# Altium project ESP32_Board - Mobile Robot.PrjPcb
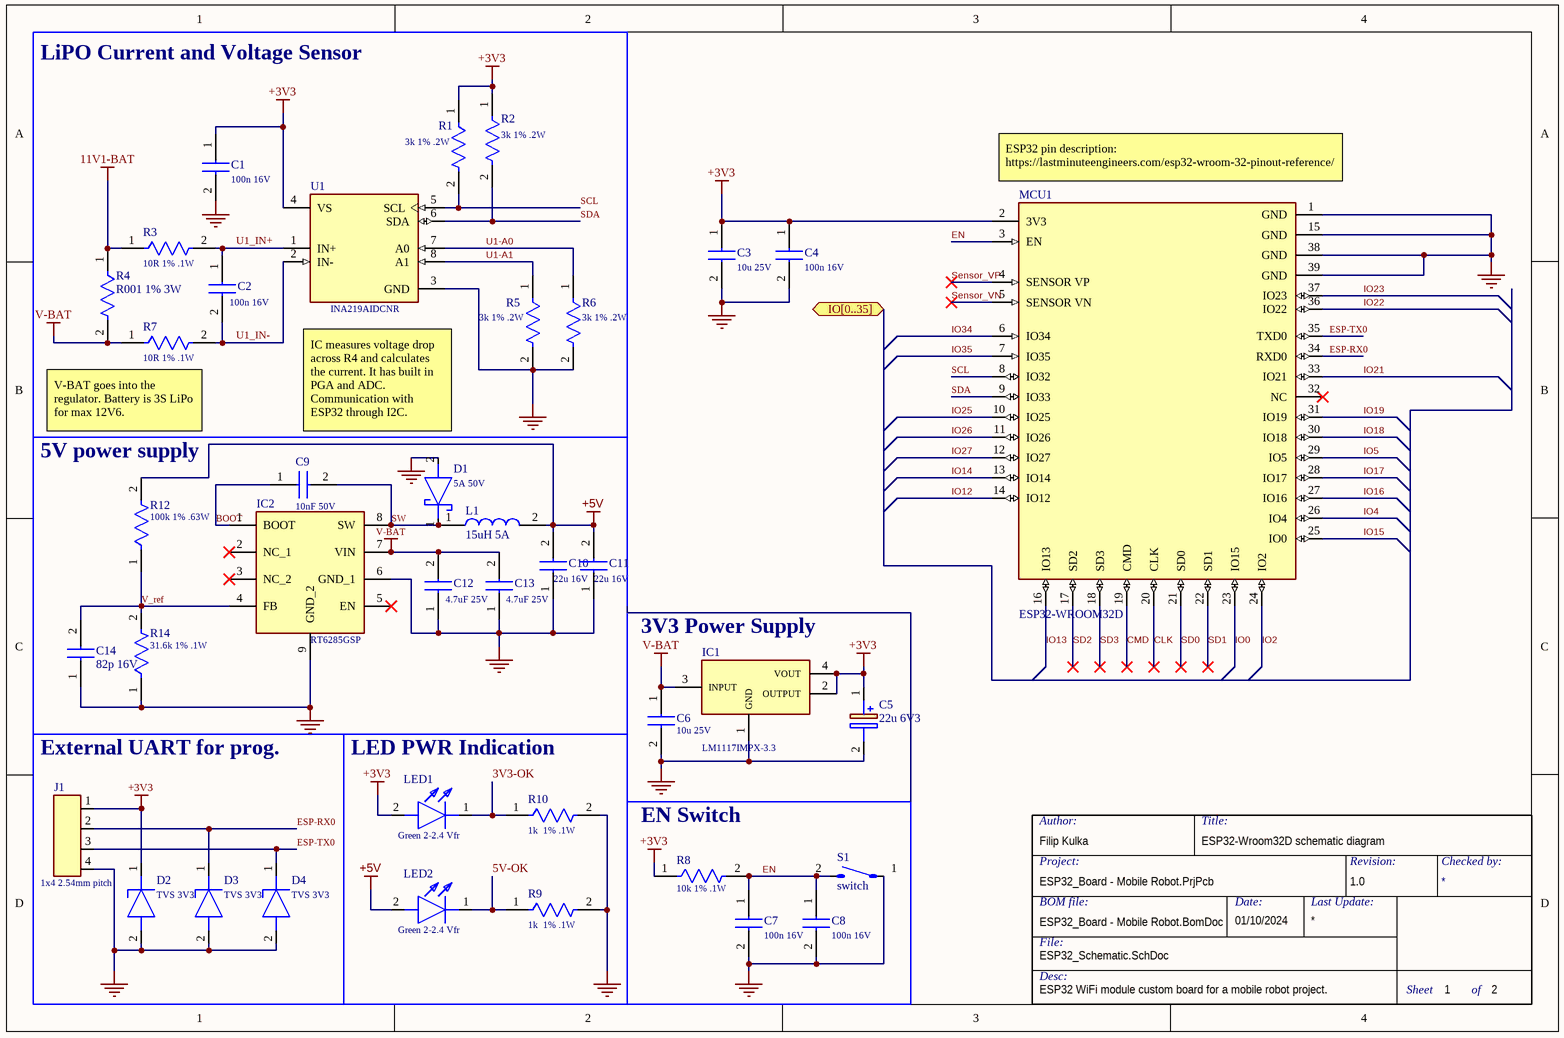
[diagram p0: ESP32_Schematic.SchDoc]

2 sheets, 66 parts. Net scope: flat (ports and power ports of the same name join across sheets).
Board file: ESP32_Board.PcbDoc
Sheets:
  ESP32_Schematic.SchDoc
  ESP32-connectors&Battery.SchDoc

## Sheet ESP32_Schematic.SchDoc: ESP32-Wroom32D schematic diagram
size A4; Date: 01/10/2024; Author: Filip Kulka; DocumentNumber: 1; Revision: 1.0; SheetNumber: 1; SheetTotal: 2; Desc: ESP32 WiFi module custom board for a mobile robot project.; BOM: ESP32_Board - Mobile Robot.BomDoc

### Parts
(Parts that share a designator on the sheet are numbered #1, #2 ... from top to bottom, then left to right.)
?#1  (no value)
C1  100n 16V  [CAPC1608X90N]
C2  100n 16V  [CAPC1608X90N]
C3  10u 25V  [CAPC1608X90N]
C4  100n 16V  [CAPC1608X90N]
C5  22u 6V3  [T491B]
C6  10u 25V  [CAPC1608X90N]
C7  100n 16V  [CAPC1608X90N]
C8  100n 16V  [CAPC1608X90N]
C9  10nF 50V  [CAPC1608X90N]
C10  22u 16V  [CAPC1608X100N]
C11  22u 16V  [CAPC1608X100N]
C12  4.7uF 25V  [CAPC1608X80N]
C13  4.7uF 25V  [CAPC1608X80N]
C14  82p 16V  [C0402C104J4RACTU]
D1  5A 50V  [DIOM7959X250N]
D2  TVS 3V3  [PESD3V3U1UB115]
D3  TVS 3V3  [PESD3V3U1UB115]
D4  TVS 3V3  [PESD3V3U1UB115]
IC1  LM1117IMPX-3.3  [SOT230P700X180-4N]
IC2  RT6285GSP  [SOIC127P600X175-9N]
J1  1x4 2.54mm pitch  [HDRV4W66P0X254_1X4_1016X249X1003P]
L1  15uH 5A  [INDPM7266X300N]
LED1  Green 2-2.4 Vfr  [LEDC1608X80N]
LED2  Green 2-2.4 Vfr  [LEDC1608X80N]
MCU1  ESP32-WROOM32D  [ESP32-Wroom32D]
R1  3k 1% .2W  [RESC1005X40N]
R2  3k 1% .2W  [RESC1005X40N]
R3  10R 1% .1W  [RESC1608X55N]
R4  R001 1% 3W  [RESC6430X80N]
R5  3k 1% .2W  [RESC1005X40N]
R6  3k 1% .2W  [RESC1005X40N]
R7  10R 1% .1W  [RESC1608X55N]
R8  10k 1% .1W  [RESC1608X60N]
R9  1k  1% .1W  [RESC1608X55N]
R10  1k  1% .1W  [RESC1608X55N]
R12  100k 1% .63W  [RESC1005X35N]
R14  31.6k 1% .1W  [RESC1005X40N]
S1  switch  [434123025816]
U1  INA219AIDCNR  [FP-DCN0008A-IPC_B]

### Ports
IO[0..35] (bidir, see ESP32-connectors&Battery[1A], ESP32-connectors&Battery[1B], ESP32-connectors&Battery[1C])

### Nets
11V1-BAT: R3.1 R4.1
+3V3: C1.1 C3.1 C4.1 C5.1(+) D2.1(K) IC1.2(OUTPUT) IC1.4(VOUT) J1.1 LED1.2(A) MCU1.2(3V3) R1.1 R2.1 R8.1 U1.4(VS)
+5V: C10.2 C11.2 L1.2 LED2.2(A) R12.2
GND: C1.2 C3.2 C4.2 C5.2(-) C6.2 C7.2 C8.2 C10.1 C11.1 C12.1 C13.1 C14.1 D1.2(A) D2.2(A) D3.2(A) D4.2(A) IC1.1(GND) IC2.6(GND_1) IC2.9(GND_2) J1.4 MCU1.1(GND) MCU1.15(GND) MCU1.38(GND) MCU1.39(GND) R5.2 R6.2 R9.2 R10.2 R14.1 S1.1(COM) U1.3(GND)
V-BAT: C6.1 C12.2 C13.2 IC1.3(INPUT) IC2.7(VIN) R4.2 R7.1
3V3-OK: LED1.1(K) R10.1
5V-OK: LED2.1(K) R9.1
BOOT: C9.1 IC2.1(BOOT)
CLK: MCU1.20(CLK)
CMD: MCU1.19(CMD)
EN: C7.1 C8.1 MCU1.3(EN) R8.2 S1.2(NO)
ESP-RX0: D3.1(K) J1.2 MCU1.34(RXD0)
ESP-TX0: D4.1(K) J1.3 MCU1.35(TXD0)
IO0: MCU1.23(IO15)
IO2: MCU1.24(IO2)
IO4: MCU1.26(IO4)
IO5: MCU1.29(IO5)
IO12: MCU1.14(IO12)
IO13: MCU1.16(IO13)
IO14: MCU1.13(IO14)
IO15: MCU1.25(IO0)
IO16: MCU1.27(IO16)
IO17: MCU1.28(IO17)
IO18: MCU1.30(IO18)
IO19: MCU1.31(IO19)
IO21: MCU1.33(IO21)
IO22: MCU1.36(IO22)
IO23: MCU1.37(IO23)
IO25: MCU1.10(IO25)
IO26: MCU1.11(IO26)
IO27: MCU1.12(IO27)
IO34: MCU1.6(IO34)
IO35: MCU1.7(IO35)
SCL: MCU1.8(IO32) R1.2 U1.5(SCL)
SD0: MCU1.21(SD0)
SD1: MCU1.22(SD1)
SD2: MCU1.17(SD2)
SD3: MCU1.18(SD3)
SDA: MCU1.9(IO33) R2.2 U1.6(SDA)
Sensor_VN: MCU1.5(SENSOR_VN)
Sensor_VP: MCU1.4(SENSOR_VP)
SW: C9.2 D1.1(K) IC2.8(SW) L1.1
U1-A0: R6.1 U1.7(A0)
U1-A1: R5.1 U1.8(A1)
U1_IN+: C2.1 R3.2 U1.1(IN+)
U1_IN-: C2.2 R7.2 U1.2(IN-)
V_ref: C14.2 IC2.4(FB) R12.1 R14.2

Not connected (* = marked no-connect by the designer): IC2 2(NC_1)* 3(NC_2)* 5(EN)*; MCU1 32(NC)*

### Notes on the sheet
- LiPO Current and Voltage Sensor
- (near MCU1) ESP32 pin description:
  https://lastminuteengineers.com/esp32-wroom-32-pinout-reference/
- (near R7) V-BAT goes into the regulator. Battery is 3S LiPo for max 12V6.
- IC measures voltage drop across R4 and calculates the current. It has built in PGA and ADC. Communication with ESP32 through I2C.
- (near R12) 5V power supply
- (near IC1) 3V3 Power Supply
- External UART for prog.
- LED PWR Indication
- EN Switch
- Author:
- Title:
- Project:
- BOM file:
- Date:
- Last Update:
- Revision:
- Checked by:
- File:
- Desc:
- Sheet
- of

### Library data of the parts
?#1 = TitleBlock: This is a custom title block with my logo and a bit more info than the default one
C1 C2 C4 C7 C8 = 0603YC104K4T4A: 100nF 0603 16V; Manufacturer_Name: Kyocera AVX; Datasheet Link: https://componentsearchengine.com/Datasheets/1/06031A100FAT2A.pdf; Height: 0.9mm; Manufacturer_Part_Number: 0603YC104K4T4A; Mouser Part Number: 581-0603YC104K4T4A; Mouser Price/Stock: https://www.mouser.co.uk/ProductDetail/KYOCERA-AVX/0603YC104K4T4A?qs=Cej1j9ztgjEkPqVJkA4Bng%3D%3D; Arrow Part Number: 0603YC104K4T4A; Arrow Price/Stock: https://www.arrow.com/en/products/0603yc104k4t4a/avx
C3 C6 = 06033D106KAT2A: Cap. Ceramic 10uF 25V 10%; Manufacturer_Name: Kyocera AVX; Datasheet Link: https://componentsearchengine.com/Datasheets/1/06031A100FAT2A.pdf; Height: 0.9mm; Manufacturer_Part_Number: 06033D106KAT2A; Mouser Part Number: 581-06033D106KAT2A; Mouser Price/Stock: https://www.mouser.co.uk/ProductDetail/KYOCERA-AVX/06033D106KAT2A?qs=iLbezkQI%252BsjjhfqLL0ayMQ%3D%3D; Arrow Part Number: 06033D106KAT2A; Arrow Price/Stock: https://www.arrow.com/en/products/06033d106kat2a/avx?region=nac
C5 = T491B226K006AT: Capacitor Polarised; Manufacturer_Name: KEMET; Datasheet Link: https://content.kemet.com/datasheets/KEM_T2005_T491.pdf; Height: 2.1mm; Manufacturer_Part_Number: T491B226K006AT; Mouser Part Number: 80-T491B226K006; Mouser Price/Stock: https://www.mouser.co.uk/ProductDetail/KEMET/T491B226K006AT?qs=jcsBHvPDQt8yMdJgz62biA%3D%3D
C9 = GCM188R71H103KA37J: 10nF 50V 0603; Manufacturer_Name: Murata Electronics; Datasheet Link: https://psearch.en.murata.com/capacitor/product/GCM188R71H103KA37%23.pdf; Height: 0.9mm; Manufacturer_Part_Number: GCM188R71H103KA37J; Mouser Part Number: 81-GCM188R71H103KA7J; Mouser Price/Stock: https://www.mouser.co.uk/ProductDetail/Murata-Electronics/GCM188R71H103KA37J?qs=N3Kl9KD794T3%2FxlXdF0Axg%3D%3D; Arrow Part Number: GCM188R71H103KA37J; Arrow Price/Stock: https://www.arrow.com/en/products/gcm188r71h103ka37j/murata-manufacturing?region=nac
C10 C11 = CM105X5R226M16AT: 22uF 16V 0603 ceramic capacitor; Manufacturer_Name: Kyocera AVX; Datasheet Link: https://www.mouser.de/datasheet/2/40/Kyocera_AVX_Components_CT_Series_e-2933596.pdf; Height: 1mm; Manufacturer_Part_Number: CM105X5R226M16AT; Mouser Part Number: 581-CM105X5R226M16AT; Mouser Price/Stock: https://www.mouser.co.uk/ProductDetail/KYOCERA-AVX/CM105X5R226M16AT?qs=MyNHzdoqoQKX6cMyStcF%2FA%3D%3D
C12 C13 = C1608X5R1E475K080AC: 4.7uF 25V 10% X5R; Manufacturer_Name: TDK; Datasheet Link: https://product.tdk.com/info/en/catalog/datasheets/mlcc_commercial_midvoltage_en.pdf; Height: 0.8mm; Manufacturer_Part_Number: C1608X5R1E475K080AC; Mouser Part Number: 810-C1608X5R1E475K; Mouser Price/Stock: https://www.mouser.co.uk/ProductDetail/TDK/C1608X5R1E475K080AC?qs=dfay7wIA1uHUGZGvnFtOyQ%3D%3D; Arrow Part Number: C1608X5R1E475K080AC; Arrow Price/Stock: https://www.arrow.com/en/products/c1608x5r1e475k080ac/tdk?region=nac
C14 = C0402C820M4GACTU: 82pF 16V; Manufacturer_Name: KEMET; Datasheet Link: https://content.kemet.com/datasheets/KEM_C1002_X7R_SMD.pdf; Height: 0.55mm; Manufacturer_Part_Number: C0402C820M4GACTU
D1 = B550C-13-F: Schotkky Diode; Manufacturer_Name: Diodes Incorporated; Datasheet Link: https://www.mouser.com/ds/2/115/ds13012-1142526.pdf; Height: 2.5mm; Manufacturer_Part_Number: B550C-13-F; Mouser Part Number: 621-B550C-F; Mouser Price/Stock: https://www.mouser.co.uk/ProductDetail/Diodes-Incorporated/B550C-13-F?qs=UEP5Ic6BRave1jzuZzz4FA%3D%3D; Arrow Part Number: B550C-13-F; Arrow Price/Stock: https://www.arrow.com/en/products/b550c-13-f/diodes-incorporated?utm_currency=USD&region=nac
D2-D4 = PESD3V3U1UB,115: TVS diode 3V3 0402; Manufacturer_Name: Nexperia; Datasheet Link: https://assets.nexperia.com/documents/data-sheet/PESD3V3U1UB.pdf; Height: 0.65mm; Manufacturer_Part_Number: PESD3V3U1UB,115; Mouser Part Number: 771-PESD3V3U1UB-T/R; Mouser Price/Stock: https://www.mouser.co.uk/ProductDetail/Nexperia/PESD3V3U1UB115?qs=LOCUfHb8d9uLhBP9O5uXGg%3D%3D; Arrow Part Number: PESD3V3U1UB,115; Arrow Price/Stock: https://www.arrow.com/en/products/pesd3v3u1ub115/nexperia?region=nac
IC1 = LM1117IMP-3.3_NOPB: 3V3 Linear regulator; Manufacturer_Name: Texas Instruments; Manufacturer_Part_Number: LM1117IMP-3.3/NOPB; Datasheet Link: https://www.ti.com/lit/ds/symlink/lm1117.pdf?ts=1607578196475&ref_url=https%253A%252F%252Fwww.google.com%252F; Height: 1.8mm; Mouser Part Number: 926-LM1117IMP3.3NOPB; Mouser Price/Stock: https://www.mouser.co.uk/ProductDetail/Texas-Instruments/LM1117IMP-3.3-NOPB?qs=X1J7HmVL2ZFbpN1TgOsjYQ%3D%3D; Arrow Part Number: LM1117IMP-3.3/NOPB; Arrow Price/Stock: https://www.arrow.com/en/products/lm1117imp-3.3nopb/texas-instruments?utm_currency=USD&region=nac; Supplier 1: Mouser; Supplier Part Number 1: 926-LM1117IMP3.3NOPB
IC2 = RT6285GSP: Integrated Circuit; Manufacturer_Name: RICHTEK; Datasheet Link: https://www.richtek.com/assets/product_file/RT6285/DS6285-00.pdf; Height: 1.753mm; Manufacturer_Part_Number: RT6285GSP; Mouser Part Number: 835-RT6285GSP; Mouser Price/Stock: https://www.mouser.co.uk/ProductDetail/Richtek/RT6285GSP?qs=amGC7iS6iy9ag0U80PgEbw%3D%3D
J1 = 22-28-4042: Connector 1x4 / 2.54mm pitch / Through Hole straight; Manufacturer_Name: Molex; Datasheet Link: https://www.molex.com/content/dam/molex/molex-dot-com/products/automated/en-us/salesdrawingpdf/423/42375/022284042_sd.pdf?inline; Height: 10.03mm; Manufacturer_Part_Number: 22-28-4042; Mouser Part Number: 538-22-28-4042; Mouser Price/Stock: https://www.mouser.co.uk/ProductDetail/Molex/22-28-4042?qs=GAPJcf4kvdu6DqYOOlzdaQ%3D%3D
L1 = ASPI-0630LR-150M-T15: Manufacturer_Name: ABRACON; Datasheet Link: https://abracon.com/Magnetics/power/ASPI-0630LR.pdf; Height: 3mm; Manufacturer_Part_Number: ASPI-0630LR-150M-T15; Mouser Part Number: 815-ASPI0630LR150T15; Mouser Price/Stock: https://www.mouser.co.uk/ProductDetail/ABRACON/ASPI-0630LR-150M-T15?qs=bWAYEm3xoCYKmwZKzI2%2F7Q%3D%3D; Arrow Part Number: ASPI-0630LR-150M-T15; Arrow Price/Stock: https://www.arrow.com/en/products/aspi-0630lr-150m-t15/abracon?region=nac
LED1 LED2 = 150060VS75000: LED green 2-2.4 Vbr; Manufacturer_Name: Wurth Elektronik; Datasheet Link: https://componentsearchengine.com/Datasheets/2/150060VS75000.pdf; Height: 0.8mm; Manufacturer_Part_Number: 150060VS75000; Mouser Part Number: 710-150060VS75000; Mouser Price/Stock: https://www.mouser.co.uk/ProductDetail/Wurth-Elektronik/150060VS75000?qs=LlUlMxKIyB1Q1Bi5mQ%2FKLw%3D%3D
MCU1 = ESP32-WROOM32D: ESP32 WiFi module with a pcb antenna
R1 R2 R5 R6 = CRCW04023K00FKEDHP: 3k 1% .2W resistor 0402 package; Manufacturer_Name: Vishay; Datasheet Link: http://www.vishay.com/docs/20035/dcrcwe3.pdf; Height: 0.4mm; Manufacturer_Part_Number: CRCW04023K00FKEDHP; Arrow Part Number: CRCW04023K00FKEDHP; Arrow Price/Stock: https://www.arrow.com/en/products/crcw04023k00fkedhp/vishay?region=nac
R3 R7 = KTR03EZPF10R0: 10R 0603 1%; Manufacturer_Name: ROHM Semiconductor; Datasheet Link: http://rohmfs.rohm.com/en/products/databook/datasheet/passive/resistor/chip_resistor/ktr.pdf; Height: 0.55mm; Manufacturer_Part_Number: KTR03EZPF10R0; Mouser Part Number: 755-KTR03EZPF10R0; Mouser Price/Stock: https://www.mouser.co.uk/ProductDetail/ROHM-Semiconductor/KTR03EZPF10R0?qs=Z4wLSx0Y7o6aTc4EM6rn5w%3D%3D
R4 = TLR3A30DR001FTDG: R001 1% 3W 2512; Manufacturer_Name: TE Connectivity; Datasheet Link: https://www.te.com/commerce/DocumentDelivery/DDEController?Action=srchrtrv&DocNm=8-1773459-4_ELEVATOR_ESCALATOR_SOLUTIONS&DocType=Data%20Sheet&DocLang=English&PartCntxt=1879378-2&DocFormat=pdf; Height: 0.8mm; Manufacturer_Part_Number: TLR3A30DR001FTDG; Mouser Part Number: 279-TLR3A30DR001FTDG; Mouser Price/Stock: https://www.mouser.co.uk/ProductDetail/TE-Connectivity-Holsworthy/TLR3A30DR001FTDG?qs=s1WWODT2SXXgi9KRS%2FP%252BSA%3D%3D; Arrow Part Number: TLR3A30DR001FTDG; Arrow Price/Stock: https://www.arrow.com/en/products/tlr3a30dr001ftdg/te-connectivity
R8 = CRT0603-FZ-1002ELF: 10k Resistor 1% 1/10W 0603; Manufacturer_Name: Bourns; Datasheet Link: https://componentsearchengine.com/Datasheets/1/CRT0603-FZ-1002ELF.pdf; Height: 0.6mm; Manufacturer_Part_Number: CRT0603-FZ-1002ELF; Mouser Part Number: 652-CRT0603FZ1002ELF; Mouser Price/Stock: https://www.mouser.com/Search/Refine.aspx?Keyword=652-CRT0603FZ1002ELF; Arrow Part Number: CRT0603-FZ-1002ELF; Arrow Price/Stock: https://www.arrow.com/en/products/crt0603-fz-1002elf/bourns
R9 R10 = CRT0603AFY-1001ELF: 1k Resistor 1% 1/10W 0603; Manufacturer_Name: Bourns; Datasheet Link: https://www.bourns.com/docs/Product-Datasheets/CRT-A.pdf; Height: 0.55mm; Manufacturer_Part_Number: CRT0603AFY-1001ELF
R12 = CRCW0402100KFKEDC: 100k 1% .63W 0402; Manufacturer_Name: Vishay; Datasheet Link: http://www.vishay.com/docs/28773/crcwce3.pdf; Height: 0.35mm; Manufacturer_Part_Number: CRCW0402100KFKEDC; Mouser Part Number: 71-CRCW0402100KFKEDC; Mouser Price/Stock: https://www.mouser.co.uk/ProductDetail/Vishay-Dale/CRCW0402100KFKEDC?qs=E3Y5ESvWgWPiKlL6PvtQMQ%3D%3D; Arrow Part Number: CRCW0402100KFKEDC; Arrow Price/Stock: https://www.arrow.com/en/products/crcw0402100kfkedc/vishay?utm_currency=USD&region=nac
R14 = CR0402-FX-3162GLF: 31.6k 1% .1W 0402 resistor; Manufacturer_Name: Bourns; Datasheet Link: https://www.bourns.com/pdfs/CR0402.pdf; Height: 0.4mm; Manufacturer_Part_Number: CR0402-FX-3162GLF
S1 = 434123025816: Manufacturer_Name: Wurth Elektronik; Datasheet Link: https://www.we-online.com/catalog/datasheet/434123025816.pdf; Height: 2.65mm; Manufacturer_Part_Number: 434123025816; Mouser Part Number: 710-434123025816; Mouser Price/Stock: https://www.mouser.co.uk/ProductDetail/Wurth-Elektronik/434123025816?qs=wr8lucFkNMVuWki%252Ba3C7oA%3D%3D
U1 = CMP-0704-00041-3: IC CURRENT MONITOR 1% SOT23-8; Common Mode Rejection Ratio: 100dB; Bandwidth: 3.4MHz; Operating Supply Current: 1mA; Nominal Supply Current: 700uA; Min Input Voltage: 0V; Output Current per Channel: 10mA; Number of Amplifiers: 1; Input Offset Voltage (Vos): 100uV; Max Input Voltage: 26V; Min Supply Voltage: 3V; Max Supply Current: 5mA; Max Supply Voltage: 5.5V; Output Type: Digital; Accuracy: 1%; Radiation Hardening: No; Min Operating Temperature: -40°C; Contact Plating: Gold; REACH SVHC: No SVHC; Packaging: Tape and Reel; Max Operating Temperature: 125°C; Lead Free: Lead Free; Weight: 0.001411oz; Supply Current: 700uA; Number of Pins: 8; Length: 3mm; Quiescent Current: 700uA; Features: I²C; Height: 1.3mm; Output Current: 10mA; Case/Package: SOT-23-8; RoHS Compliant: Yes; Width: 1.75mm; Package Quantity: 3000; Series: Zero-Drift

## Sheet ESP32-connectors&Battery.SchDoc: Connectors & Battery
size A4; Date: 9/11/2024; Author: Filip Kulka; DrawnBy: Filip Kulka; DocumentNumber: 2; Revision: 1.0; SheetNumber: 2; SheetTotal: 2; Desc: Auxilary connectors for any outside peripherals; BOM: ESP32_Board - Mobile Robot.BomDoc
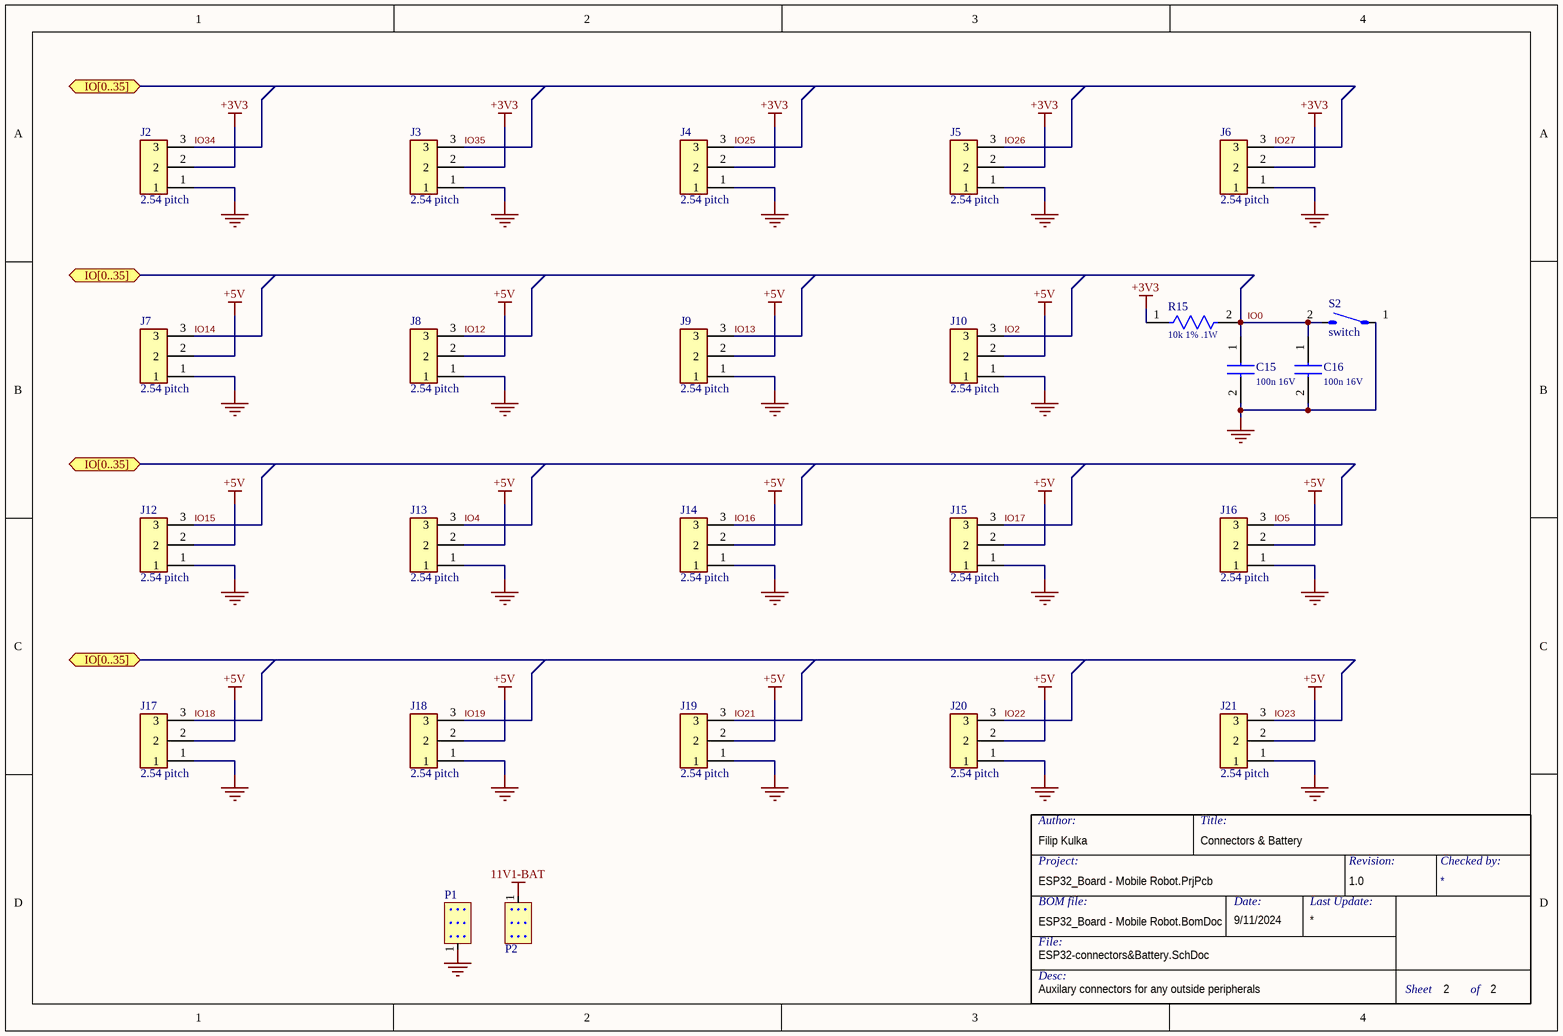
[diagram p1: ESP32-connectors&Battery.SchDoc]

### Parts
(Parts that share a designator on the sheet are numbered #1, #2 ... from top to bottom, then left to right.)
?#2  (no value)
C15  100n 16V  [CAPC1608X90N]
C16  100n 16V  [CAPC1608X90N]
J2  2.54 pitch  [HDRV3W64P0X254_1X3_762X250X952P]
J3  2.54 pitch  [HDRV3W64P0X254_1X3_762X250X952P]
J4  2.54 pitch  [HDRV3W64P0X254_1X3_762X250X952P]
J5  2.54 pitch  [HDRV3W64P0X254_1X3_762X250X952P]
J6  2.54 pitch  [HDRV3W64P0X254_1X3_762X250X952P]
J7  2.54 pitch  [HDRV3W64P0X254_1X3_762X250X952P]
J8  2.54 pitch  [HDRV3W64P0X254_1X3_762X250X952P]
J9  2.54 pitch  [HDRV3W64P0X254_1X3_762X250X952P]
J10  2.54 pitch  [HDRV3W64P0X254_1X3_762X250X952P]
J12  2.54 pitch  [HDRV3W64P0X254_1X3_762X250X952P]
J13  2.54 pitch  [HDRV3W64P0X254_1X3_762X250X952P]
J14  2.54 pitch  [HDRV3W64P0X254_1X3_762X250X952P]
J15  2.54 pitch  [HDRV3W64P0X254_1X3_762X250X952P]
J16  2.54 pitch  [HDRV3W64P0X254_1X3_762X250X952P]
J17  2.54 pitch  [HDRV3W64P0X254_1X3_762X250X952P]
J18  2.54 pitch  [HDRV3W64P0X254_1X3_762X250X952P]
J19  2.54 pitch  [HDRV3W64P0X254_1X3_762X250X952P]
J20  2.54 pitch  [HDRV3W64P0X254_1X3_762X250X952P]
J21  2.54 pitch  [HDRV3W64P0X254_1X3_762X250X952P]
P1  Battery pins with pad vias  [Battery Pad]  (value not drawn)
P2  Battery pins with pad vias  [Battery Pad]  (value not drawn)
R15  10k 1% .1W  [RESC1608X60N]
S2  switch  [434123025816]

### Ports
IO[0..35] (bidir, see ESP32-connectors&Battery[1A], ESP32-connectors&Battery[1B], ESP32-connectors&Battery[1C], ESP32_Schematic[3B]), IO[0..35] (bidir, see ESP32-connectors&Battery[1A], ESP32-connectors&Battery[1B], ESP32_Schematic[3B]), IO[0..35] (bidir, see ESP32-connectors&Battery[1B], ESP32-connectors&Battery[1C], ESP32_Schematic[3B])

### Nets
11V1-BAT: P2.1
+3V3: J2.2 J3.2 J4.2 J5.2 J6.2 R15.1
+5V: J7.2 J8.2 J9.2 J10.2 J12.2 J13.2 J14.2 J15.2 J16.2 J17.2 J18.2 J19.2 J20.2 J21.2
GND: C15.2 C16.2 J2.1 J3.1 J4.1 J5.1 J6.1 J7.1 J8.1 J9.1 J10.1 J12.1 J13.1 J14.1 J15.1 J16.1 J17.1 J18.1 J19.1 J20.1 J21.1 P1.1 S2.1(COM)
IO0: C15.1 C16.1 R15.2 S2.2(NO)
IO2: J10.3
IO4: J13.3
IO5: J16.3
IO12: J8.3
IO13: J9.3
IO14: J7.3
IO15: J12.3
IO16: J14.3
IO17: J15.3
IO18: J17.3
IO19: J18.3
IO21: J19.3
IO22: J20.3
IO23: J21.3
IO25: J4.3
IO26: J5.3
IO27: J6.3
IO34: J2.3
IO35: J3.3

### Notes on the sheet
- Author:
- Title:
- Project:
- BOM file:
- Date:
- Last Update:
- Revision:
- Checked by:
- File:
- Desc:
- Sheet
- of

### Library data of the parts
?#2 = TitleBlock: as ?#1 on sheet ESP32_Schematic
C15 C16 = 0603YC104K4T4A: as C1 on sheet ESP32_Schematic; Datasheet Link: https://componentsearchengine.com/Datasheets/1/06031A100FAT2A.pdf; Height: 0.9mm; Manufacturer_Part_Number: 0603YC104K4T4A; Mouser Part Number: 581-0603YC104K4T4A; Mouser Price/Stock: https://www.mouser.co.uk/ProductDetail/KYOCERA-AVX/0603YC104K4T4A?qs=Cej1j9ztgjEkPqVJkA4Bng%3D%3D; Arrow Part Number: 0603YC104K4T4A; Arrow Price/Stock: https://www.arrow.com/en/products/0603yc104k4t4a/avx
J2-J10 J12-J21 = PH1-03-UA: Connector; Manufacturer_Name: Adam Tech; Datasheet Link: https://datasheet.datasheetarchive.com/originals/distributors/Datasheets_SAMA/34c52fbb4019bb4b288b881302863af3.pdf; Height: 9.516mm; Manufacturer_Part_Number: PH1-03-UA; Mouser Part Number: 737-PH1-03-UA; Mouser Price/Stock: https://www.mouser.co.uk/ProductDetail/Adam-Tech/PH1-03-UA?qs=HoCaDK9Nz5cktq3WKneQTQ%3D%3D; Arrow Part Number: PH1-03-UA; Arrow Price/Stock: https://www.arrow.com/en/products/ph1-03-ua/adam-tech?region=nac
P1 P2 = Battery Pad
R15 = CRT0603-FZ-1002ELF: as R8 on sheet ESP32_Schematic; Datasheet Link: https://componentsearchengine.com/Datasheets/1/CRT0603-FZ-1002ELF.pdf; Height: 0.6mm; Manufacturer_Part_Number: CRT0603-FZ-1002ELF; Mouser Part Number: 652-CRT0603FZ1002ELF; Mouser Price/Stock: https://www.mouser.com/Search/Refine.aspx?Keyword=652-CRT0603FZ1002ELF; Arrow Part Number: CRT0603-FZ-1002ELF; Arrow Price/Stock: https://www.arrow.com/en/products/crt0603-fz-1002elf/bourns
S2 = 434123025816: Manufacturer_Name: Wurth Elektronik; Datasheet Link: https://www.we-online.com/catalog/datasheet/434123025816.pdf; Height: 2.65mm; Manufacturer_Part_Number: 434123025816; Mouser Part Number: 710-434123025816; Mouser Price/Stock: https://www.mouser.co.uk/ProductDetail/Wurth-Elektronik/434123025816?qs=wr8lucFkNMVuWki%252Ba3C7oA%3D%3D

## Nets that join several sheets
11V1-BAT: ESP32_Schematic (R3.1 R4.1), ESP32-connectors&Battery (P2.1)
+3V3: ESP32_Schematic (14 pins), ESP32-connectors&Battery (6 pins)
+5V: ESP32_Schematic (5 pins), ESP32-connectors&Battery (14 pins)
GND: ESP32_Schematic (31 pins), ESP32-connectors&Battery (23 pins)